# EAGLE design hc05_breakout (EAGLE 7.5.0)
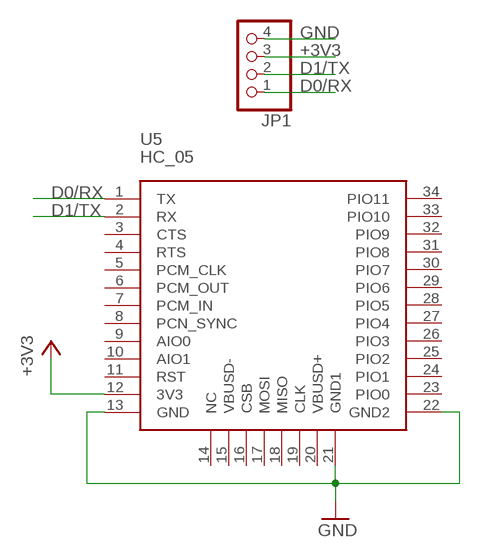
[diagram p0: schematic, sheet 1]

## Parts
JP1  PINHD-1X4  [1X04]
U5  HC_05  [BLUETOOTH_SMD]

## Nets
+3V3: JP1.3 U5.12(3V3)
D0/RX: JP1.1 U5.1(TX)
D1/TX: JP1.2 U5.2(RX)
GND: JP1.4 U5.13(GND) U5.21(GND1) U5.22(GND2)
Unconnected: U5.3(CTS) U5.4(RTS) U5.5(PCM_CLK) U5.6(PCM_OUT) U5.7(PCM_IN) U5.8(PCN_SYNC) U5.9(AIO0) U5.10(AIO1) U5.11(RST) U5.14(NC) U5.15(VBUSD-) U5.16(CSB) U5.17(MOSI) U5.18(MISO) U5.19(CLK) U5.20(VBUSD+) U5.23(PIO0) U5.24(PIO1) U5.25(PIO2) U5.26(PIO3) U5.27(PIO4) U5.28(PIO5) U5.29(PIO6) U5.30(PIO7) U5.31(PIO8) U5.32(PIO9) U5.33(PIO10) U5.34(PIO11)

## Library data of the parts
JP1 = pinhead:PINHD-1X4: PIN HEADER
U5 = HC-05:HC_05: HC-05 Bluetooth Module

## Net classes
0 default: clearance 0.205 mm

## Board
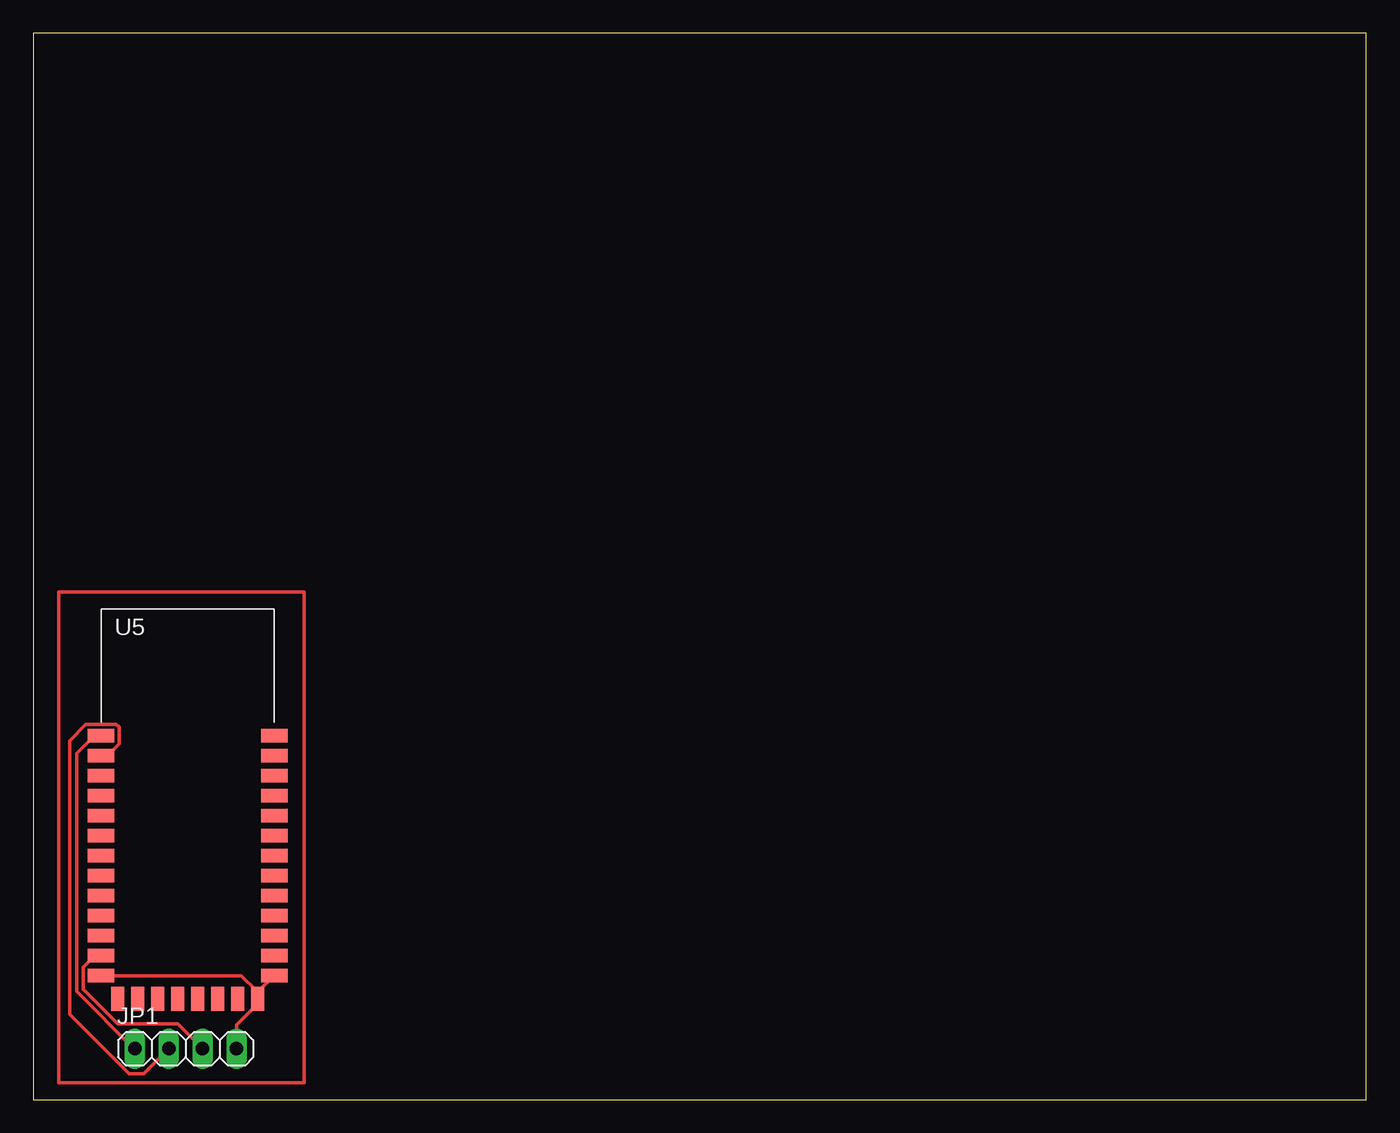
[diagram p1: board, top side]

Size 100 x 80 mm. Coordinates in mm from the lower left corner, seen from the top.
Outline: 0,0 100,0 100,80 0,80 0,0
Copper layers (1*16): Top 0.035mm / dielectric 1.5mm / Bottom 0.035mm
Design rules "default": minimum track width 10mil, minimum drill 24mil, track to track 8mil, track to pad 8mil, pad to pad 8mil, via to via 8mil, smd to smd 8mil, copper to edge 40mil, drill to drill 8mil, minimum pad ring 10mil, minimum via ring 8mil, stop-mask expansion 4mil, vias tented up to drill 0mil, thermal gap 10mil

### Footprints (pad centres in the part's own frame; a part is rotated, then mirrored left to right if it is on the bottom)
1X04 = drill 1.016 long: 1 -3.81,0; 2 -1.27,0; 3 1.27,0; 4 3.81,0
BLUETOOTH_SMD = smd 2 x 1: 1 -6.35,3.81; 2 -6.35,2.31; 3 -6.35,0.81; 4 -6.35,-0.69; 5 -6.35,-2.19; 6 -6.35,-3.69; 7 -6.35,-5.19; 8 -6.35,-6.69; 9 -6.35,-8.19; 10 -6.35,-9.69; 11 -6.35,-11.19; 12 -6.35,-12.69; 13 -6.35,-14.19; 22 6.65,-14.19; 23 6.65,-12.69; 24 6.65,-11.19; 25 6.65,-9.69; 26 6.65,-8.19; 27 6.65,-6.69; 28 6.65,-5.19; 29 6.65,-3.69; 30 6.65,-2.19; 31 6.65,-0.69; 32 6.65,0.81; 33 6.65,2.31; 34 6.65,3.81 | smd 1 x 1.8: 14 -5.1,-15.94; 15 -3.6,-15.94; 16 -2.1,-15.94; 17 -0.6,-15.94; 18 0.9,-15.94; 19 2.4,-15.94; 20 3.9,-15.94; 21 5.4,-15.94

### Placement (x,y rotation side)
JP1  11.43,3.81 0 top
U5  11.43,23.5 0 top

### Tracks (layer width: path | path; a pad name or v marks a point on that pad's centre or on a via)
+3V3
  Top 0.254: JP1.3 10.82,5.69 6.33,5.69 3.73,8.28 3.73,9.93 4.6,10.79 5.08,10.79 U5.12
D0/RX
  Top 0.254: U5.1 4.6,27.3 3.25,25.96 3.25,8.1 7.54,3.81 JP1.1
D1/TX
  Top 0.254: JP1.2 8.28,1.93 7.19,1.93 2.72,6.4 2.72,26.92 3.94,28.14 6.22,28.14 6.43,27.94 6.43,26.67 5.56,25.81 U5.2
GND
  Top 0.254: U5.21 16.84,8.08 18.06,9.3 U5.22 | U5.13 5.08,9.3 15.6,9.3 16.74,8.15 U5.21 | JP1.4 15.24,5.59 16.79,7.14 16.79,7.44 U5.21
N$1
  Top 0.254: 1.91,1.27 1.91,38.1 20.32,38.1 20.32,1.27 1.91,1.27